# Altium schematic sheet Sensor Bar 2.0 signal LED.SchDoc
size A4
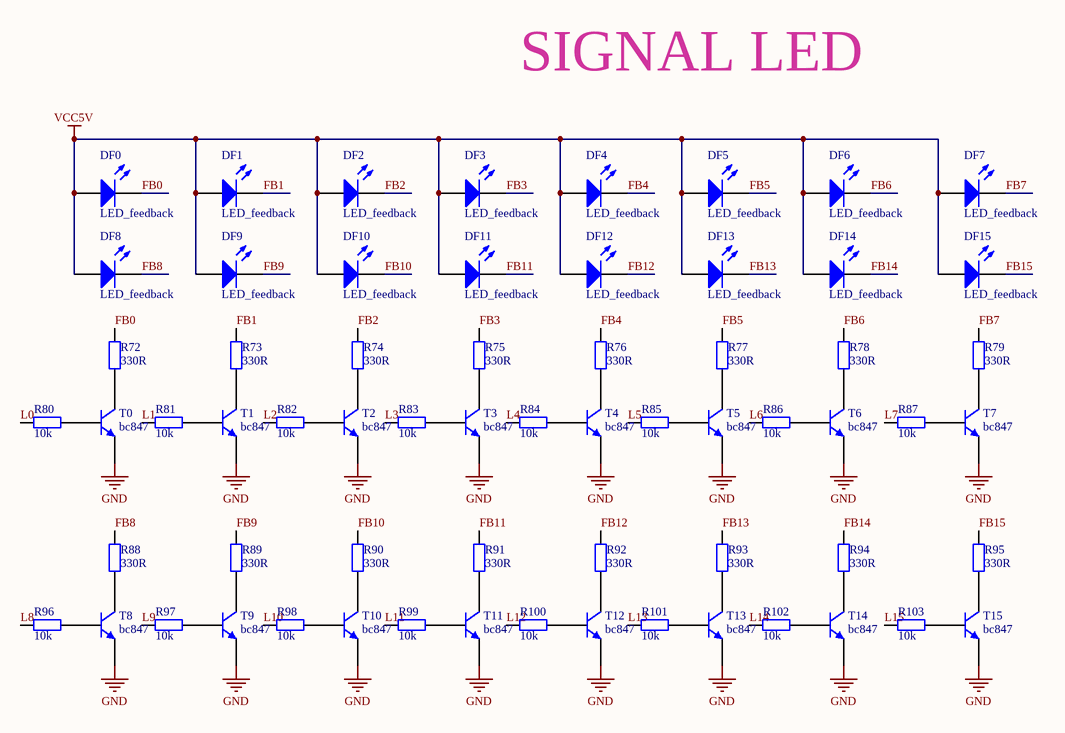
[diagram p0: Sensor Bar 2.0 signal LED.SchDoc]

## Parts
DF0  LED_feedback  [SMD _LED]
DF1  LED_feedback  [SMD _LED]
DF2  LED_feedback  [SMD _LED]
DF3  LED_feedback  [SMD _LED]
DF4  LED_feedback  [SMD _LED]
DF5  LED_feedback  [SMD _LED]
DF6  LED_feedback  [SMD _LED]
DF7  LED_feedback  [SMD _LED]
DF8  LED_feedback  [SMD _LED]
DF9  LED_feedback  [SMD _LED]
DF10  LED_feedback  [SMD _LED]
DF11  LED_feedback  [SMD _LED]
DF12  LED_feedback  [SMD _LED]
DF13  LED_feedback  [SMD _LED]
DF14  LED_feedback  [SMD _LED]
DF15  LED_feedback  [SMD _LED]
R72  330R  [CR2012-0805]
R73  330R  [CR2012-0805]
R74  330R  [CR2012-0805]
R75  330R  [CR2012-0805]
R76  330R  [CR2012-0805]
R77  330R  [CR2012-0805]
R78  330R  [CR2012-0805]
R79  330R  [CR2012-0805]
R80  10k  [CR2012-0805]
R81  10k  [CR2012-0805]
R82  10k  [CR2012-0805]
R83  10k  [CR2012-0805]
R84  10k  [CR2012-0805]
R85  10k  [CR2012-0805]
R86  10k  [CR2012-0805]
R87  10k  [CR2012-0805]
R88  330R  [CR2012-0805]
R89  330R  [CR2012-0805]
R90  330R  [CR2012-0805]
R91  330R  [CR2012-0805]
R92  330R  [CR2012-0805]
R93  330R  [CR2012-0805]
R94  330R  [CR2012-0805]
R95  330R  [CR2012-0805]
R96  10k  [CR2012-0805]
R97  10k  [CR2012-0805]
R98  10k  [CR2012-0805]
R99  10k  [CR2012-0805]
R100  10k  [CR2012-0805]
R101  10k  [CR2012-0805]
R102  10k  [CR2012-0805]
R103  10k  [CR2012-0805]
T0  bc847  [npn]
T1  bc847  [npn]
T2  bc847  [npn]
T3  bc847  [npn]
T4  bc847  [npn]
T5  bc847  [npn]
T6  bc847  [npn]
T7  bc847  [npn]
T8  bc847  [npn]
T9  bc847  [npn]
T10  bc847  [npn]
T11  bc847  [npn]
T12  bc847  [npn]
T13  bc847  [npn]
T14  bc847  [npn]
T15  bc847  [npn]

## Nets
GND: T0.2(E) T1.2(E) T2.2(E) T3.2(E) T4.2(E) T5.2(E) T6.2(E) T7.2(E) T8.2(E) T9.2(E) T10.2(E) T11.2(E) T12.2(E) T13.2(E) T14.2(E) T15.2(E)
VCC5V: DF0.1(A) DF1.1(A) DF2.1(A) DF3.1(A) DF4.1(A) DF5.1(A) DF6.1(A) DF7.1(A) DF8.1(A) DF9.1(A) DF10.1(A) DF11.1(A) DF12.1(A) DF13.1(A) DF14.1(A) DF15.1(A)
FB0: DF0.2(K) R72.2
FB1: DF1.2(K) R73.2
FB2: DF2.2(K) R74.2
FB3: DF3.2(K) R75.2
FB4: DF4.2(K) R76.2
FB5: DF5.2(K) R77.2
FB6: DF6.2(K) R78.2
FB7: DF7.2(K) R79.2
FB8: DF8.2(K) R88.2
FB9: DF9.2(K) R89.2
FB10: DF10.2(K) R90.2
FB11: DF11.2(K) R91.2
FB12: DF12.2(K) R92.2
FB13: DF13.2(K) R93.2
FB14: DF14.2(K) R94.2
FB15: DF15.2(K) R95.2
L0: R80.2
L1: R81.2
L2: R82.2
L3: R83.2
L4: R84.2
L5: R85.2
L6: R86.2
L7: R87.2
L8: R96.2
L9: R97.2
L10: R98.2
L11: R99.2
L12: R100.2
L13: R101.2
L14: R102.2
L15: R103.2
NetR72_1: R72.1 T0.3(C)
NetR73_1: R73.1 T1.3(C)
NetR74_1: R74.1 T2.3(C)
NetR75_1: R75.1 T3.3(C)
NetR76_1: R76.1 T4.3(C)
NetR77_1: R77.1 T5.3(C)
NetR78_1: R78.1 T6.3(C)
NetR79_1: R79.1 T7.3(C)
NetR80_1: R80.1 T0.1(B)
NetR81_1: R81.1 T1.1(B)
NetR82_1: R82.1 T2.1(B)
NetR83_1: R83.1 T3.1(B)
NetR84_1: R84.1 T4.1(B)
NetR85_1: R85.1 T5.1(B)
NetR86_1: R86.1 T6.1(B)
NetR87_1: R87.1 T7.1(B)
NetR88_1: R88.1 T8.3(C)
NetR89_1: R89.1 T9.3(C)
NetR90_1: R90.1 T10.3(C)
NetR91_1: R91.1 T11.3(C)
NetR92_1: R92.1 T12.3(C)
NetR93_1: R93.1 T13.3(C)
NetR94_1: R94.1 T14.3(C)
NetR95_1: R95.1 T15.3(C)
NetR96_1: R96.1 T8.1(B)
NetR97_1: R97.1 T9.1(B)
NetR98_1: R98.1 T10.1(B)
NetR99_1: R99.1 T11.1(B)
NetR100_1: R100.1 T12.1(B)
NetR101_1: R101.1 T13.1(B)
NetR102_1: R102.1 T14.1(B)
NetR103_1: R103.1 T15.1(B)

## Notes on the sheet
- SIGNAL LED

## Library data of the parts
DF0-DF15 = LED: Typical RED GaAs LED; Published: 8-Jun-2000; LatestRevisionDate: 08-Jul-2005; LatestRevisionNote: Mech Layer 1 removed.; PackageReference: LED-1; Publisher: Altium Limited
R72-R103 = Res2: Resistor; Published: 8-Jun-2000; Revision: July-2002: Re-released for DXP Platform.; Publisher: Altium Limited
  R72-R79 R88-R95: Value: 330R
  R80-R87 R96-R103: Value: 10k
T0-T15 = npn